# Altium schematic sheet OverView_TrackCommanderCar_PowerPart.SchDoc: OverView_Track Commander Car_PowerPart
size 420 x 297 mm; Author: Truong Ngoc Minh; DocumentNumber: 06/10/2025; SheetNumber: 1; SheetTotal: 3
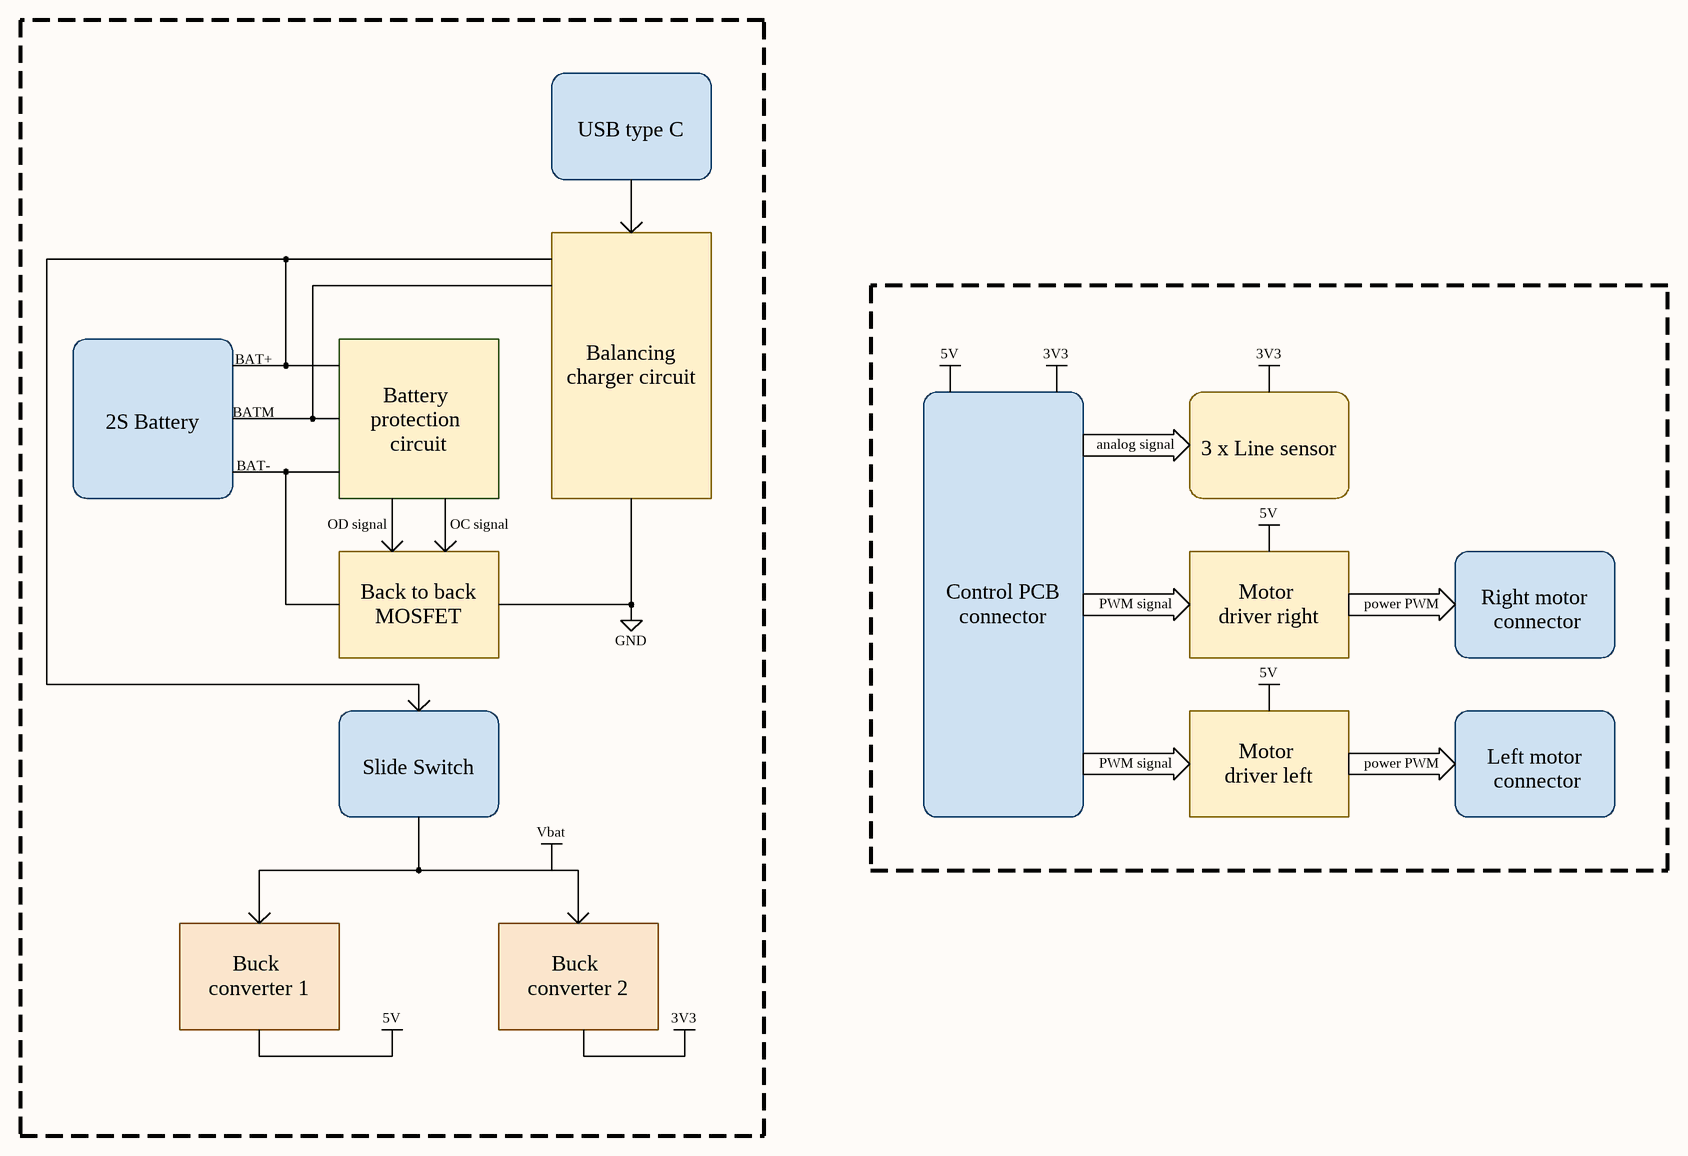
[diagram p0: OverView_TrackCommanderCar_PowerPart.SchDoc]

## Notes on the sheet
- USB type C
- BAT+
- 5V
- 3V3
- 2S Battery
- BATM
- Balancing charger circuit
- BAT-
- Battery
  protection
  circuit
- analog signal
- 3 x Line sensor
- OD signal
- OC signal
- Back to back MOSFET
- Control PCB connector
- PWM signal
- Motor
  driver right
- power PWM
- Right motor
  connector
- GND
- Slide Switch
- Motor
  driver left
- Left motor
  connector
- Vbat
- Buck
  converter 1
- Buck
  converter 2
- THIS DOCUMENT AND THE DATA DISCLOSED HEREIN OR
- HEREWITH IS THE PROPERTY OF ALTIUM LIMITED AND MAY
- DWG NO:
- REVISION
- REV:
- DESCRIPTION
- DATE
- APPROVED
- BE FREELY DISTRIBUTED IN WHOLE. NO RIGHTS ARE
- RESERVED OR EXPRESS OR IMPLIED WARANTEE GIVEN.
- ENG:
- APPROVALS
- PROJECT
- DSN:
- CHK:
- REFERENCE DOCUMENTS
- PROJECT REVISION:
- TITLE
- DOCUMENT REVISION:
- DESIGN ITEM:
- BOM:
- FAB DWG:
- PCB DWG:
- ASSY DWG:
- SCALE:
- A3
- SIZE
- CAGE CODE
- FILE NAME
- DWG NO.
- SHEET
- OF
- REV